# Altium schematic sheet XP3.SchDoc: XP3 Connections
size A; Organization: UCLA High Energy Physics; Address1: L3, 12a Rodborough Rd; Address2: Frenchs Forest; Address3: NSW; Address4: Australia 2086; DocumentNumber: 5; Revision: 2.0; SheetNumber: 5; SheetTotal: 23; CurrentDate: 9/6/2018; ModifiedDate: 9/6/2018; ProjectName: Project
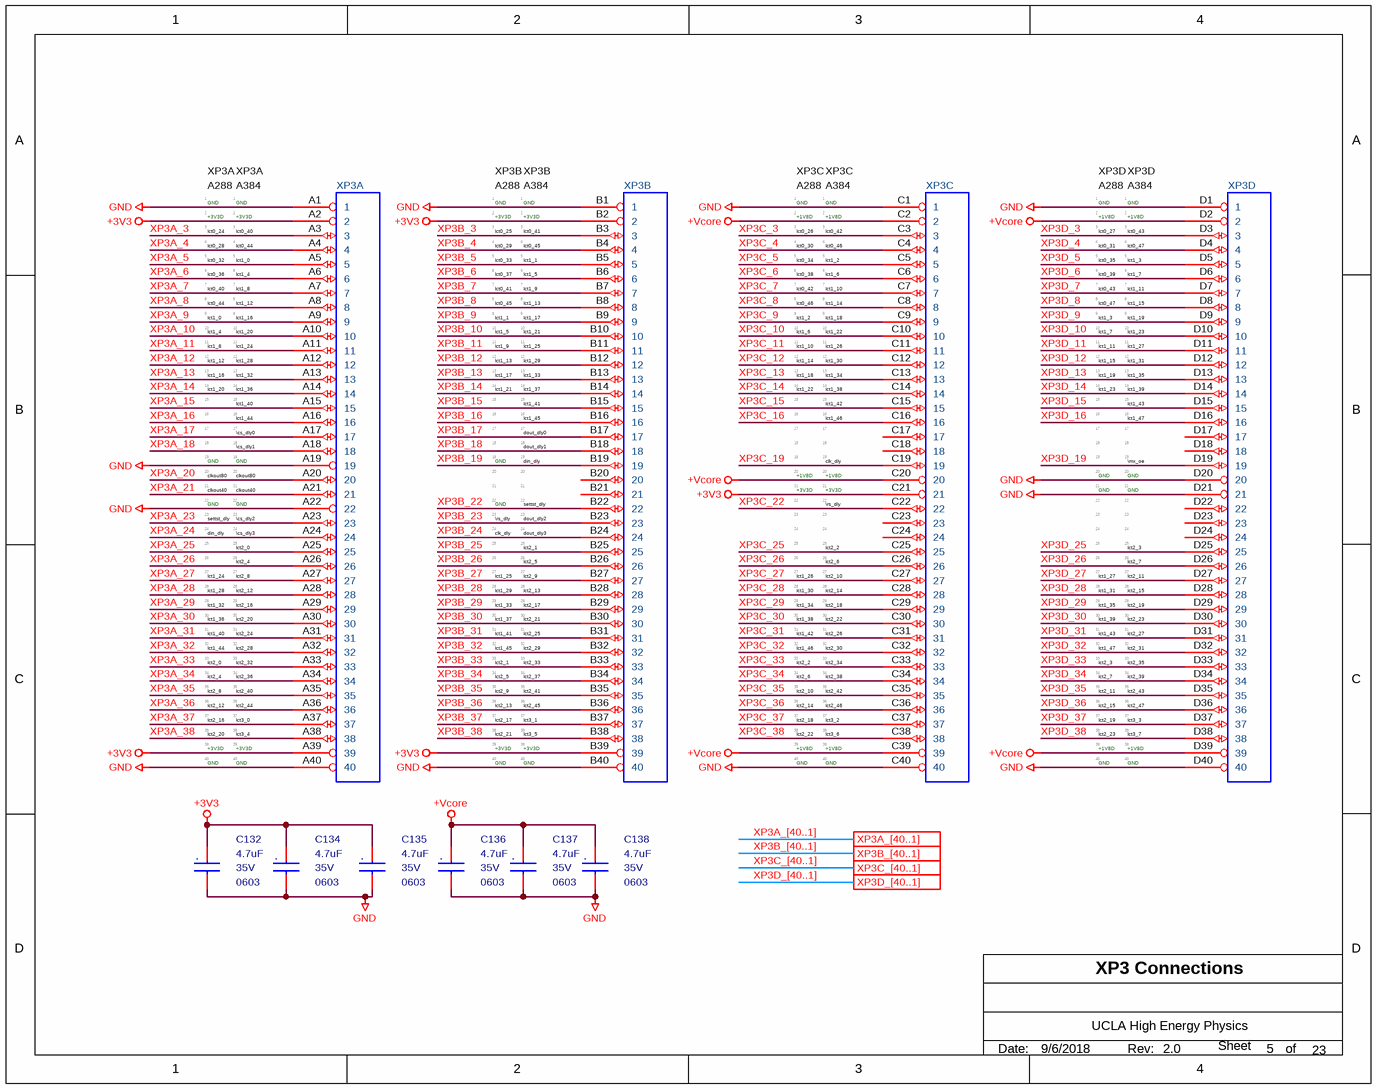
[diagram p0: XP3.SchDoc]

## Parts
(Parts that share a designator on the sheet are numbered #1, #2 ... from top to bottom, then left to right.)
C132  4.7uF  Voltage - Rated: 35V  package: 0603  [MC_S6/SM/C_0603_IPC]
C134  4.7uF  Voltage - Rated: 35V  package: 0603  [MC_S6/SM/C_0603_IPC]
C135  4.7uF  Voltage - Rated: 35V  package: 0603  [MC_S6/SM/C_0603_IPC]
C136  4.7uF  Voltage - Rated: 35V  package: 0603  [MC_S6/SM/C_0603_IPC]
C137  4.7uF  Voltage - Rated: 35V  package: 0603  [MC_S6/SM/C_0603_IPC]
C138  4.7uF  Voltage - Rated: 35V  package: 0603  [MC_S6/SM/C_0603_IPC]
XP3  Samtec_XP3  [MC_S6/TH/SAMTEC_MOLC_40x4]  (value not drawn)  (parts A,B,C,D of 4)
XP?#1  A288_XP3  (value not drawn)  (part A of 4)  (graphical)
XP?#2  A384_XP3  (value not drawn)  (part A of 4)  (graphical)
XP?#3  A288_XP3  (value not drawn)  (part B of 4)  (graphical)
XP?#4  A384_XP3  (value not drawn)  (part B of 4)  (graphical)
XP?#5  A288_XP3  (value not drawn)  (part C of 4)  (graphical)
XP?#6  A384_XP3  (value not drawn)  (part C of 4)  (graphical)
XP?#7  A288_XP3  (value not drawn)  (part D of 4)  (graphical)
XP?#8  A384_XP3  (value not drawn)  (part D of 4)  (graphical)

## Ports
XP3A_[40..1], XP3B_[40..1], XP3C_[40..1], XP3D_[40..1]

## Nets
+3V3: C132.1 C134.1 C135.1 XP3.A2(2) XP3.A39(39) XP3.B2(2) XP3.B39(39) XP3.C21(21)
+Vcore: C136.1 C137.1 C138.1 XP3.C2(2) XP3.C20(20) XP3.C39(39) XP3.D2(2) XP3.D39(39)
GND: C132.2 C134.2 C135.2 C136.2 C137.2 C138.2 XP3.A1(1) XP3.A19(19) XP3.A22(22) XP3.A40(40) XP3.B1(1) XP3.B40(40) XP3.C1(1) XP3.C40(40) XP3.D1(1) XP3.D20(20) XP3.D21(21) XP3.D40(40)
XP3A_3: XP3.A3(3)
XP3A_4: XP3.A4(4)
XP3A_5: XP3.A5(5)
XP3A_6: XP3.A6(6)
XP3A_7: XP3.A7(7)
XP3A_8: XP3.A8(8)
XP3A_9: XP3.A9(9)
XP3A_10: XP3.A10(10)
XP3A_11: XP3.A11(11)
XP3A_12: XP3.A12(12)
XP3A_13: XP3.A13(13)
XP3A_14: XP3.A14(14)
XP3A_15: XP3.A15(15)
XP3A_16: XP3.A16(16)
XP3A_17: XP3.A17(17)
XP3A_18: XP3.A18(18)
XP3A_20: XP3.A20(20)
XP3A_21: XP3.A21(21)
XP3A_23: XP3.A23(23)
XP3A_24: XP3.A24(24)
XP3A_25: XP3.A25(25)
XP3A_26: XP3.A26(26)
XP3A_27: XP3.A27(27)
XP3A_28: XP3.A28(28)
XP3A_29: XP3.A29(29)
XP3A_30: XP3.A30(30)
XP3A_31: XP3.A31(31)
XP3A_32: XP3.A32(32)
XP3A_33: XP3.A33(33)
XP3A_34: XP3.A34(34)
XP3A_35: XP3.A35(35)
XP3A_36: XP3.A36(36)
XP3A_37: XP3.A37(37)
XP3A_38: XP3.A38(38)
XP3B_3: XP3.B3(3)
XP3B_4: XP3.B4(4)
XP3B_5: XP3.B5(5)
XP3B_6: XP3.B6(6)
XP3B_7: XP3.B7(7)
XP3B_8: XP3.B8(8)
XP3B_9: XP3.B9(9)
XP3B_10: XP3.B10(10)
XP3B_11: XP3.B11(11)
XP3B_12: XP3.B12(12)
XP3B_13: XP3.B13(13)
XP3B_14: XP3.B14(14)
XP3B_15: XP3.B15(15)
XP3B_16: XP3.B16(16)
XP3B_17: XP3.B17(17)
XP3B_18: XP3.B18(18)
XP3B_19: XP3.B19(19)
XP3B_22: XP3.B22(22)
XP3B_23: XP3.B23(23)
XP3B_24: XP3.B24(24)
XP3B_25: XP3.B25(25)
XP3B_26: XP3.B26(26)
XP3B_27: XP3.B27(27)
XP3B_28: XP3.B28(28)
XP3B_29: XP3.B29(29)
XP3B_30: XP3.B30(30)
XP3B_31: XP3.B31(31)
XP3B_32: XP3.B32(32)
XP3B_33: XP3.B33(33)
XP3B_34: XP3.B34(34)
XP3B_35: XP3.B35(35)
XP3B_36: XP3.B36(36)
XP3B_37: XP3.B37(37)
XP3B_38: XP3.B38(38)
XP3C_3: XP3.C3(3)
XP3C_4: XP3.C4(4)
XP3C_5: XP3.C5(5)
XP3C_6: XP3.C6(6)
XP3C_7: XP3.C7(7)
XP3C_8: XP3.C8(8)
XP3C_9: XP3.C9(9)
XP3C_10: XP3.C10(10)
XP3C_11: XP3.C11(11)
XP3C_12: XP3.C12(12)
XP3C_13: XP3.C13(13)
XP3C_14: XP3.C14(14)
XP3C_15: XP3.C15(15)
XP3C_16: XP3.C16(16)
XP3C_19: XP3.C19(19)
XP3C_22: XP3.C22(22)
XP3C_25: XP3.C25(25)
XP3C_26: XP3.C26(26)
XP3C_27: XP3.C27(27)
XP3C_28: XP3.C28(28)
XP3C_29: XP3.C29(29)
XP3C_30: XP3.C30(30)
XP3C_31: XP3.C31(31)
XP3C_32: XP3.C32(32)
XP3C_33: XP3.C33(33)
XP3C_34: XP3.C34(34)
XP3C_35: XP3.C35(35)
XP3C_36: XP3.C36(36)
XP3C_37: XP3.C37(37)
XP3C_38: XP3.C38(38)
XP3D_3: XP3.D3(3)
XP3D_4: XP3.D4(4)
XP3D_5: XP3.D5(5)
XP3D_6: XP3.D6(6)
XP3D_7: XP3.D7(7)
XP3D_8: XP3.D8(8)
XP3D_9: XP3.D9(9)
XP3D_10: XP3.D10(10)
XP3D_11: XP3.D11(11)
XP3D_12: XP3.D12(12)
XP3D_13: XP3.D13(13)
XP3D_14: XP3.D14(14)
XP3D_15: XP3.D15(15)
XP3D_16: XP3.D16(16)
XP3D_19: XP3.D19(19)
XP3D_25: XP3.D25(25)
XP3D_26: XP3.D26(26)
XP3D_27: XP3.D27(27)
XP3D_28: XP3.D28(28)
XP3D_29: XP3.D29(29)
XP3D_30: XP3.D30(30)
XP3D_31: XP3.D31(31)
XP3D_32: XP3.D32(32)
XP3D_33: XP3.D33(33)
XP3D_34: XP3.D34(34)
XP3D_35: XP3.D35(35)
XP3D_36: XP3.D36(36)
XP3D_37: XP3.D37(37)
XP3D_38: XP3.D38(38)

Not connected (* = marked no-connect by the designer): XP3 B20(20) B21(21) C17(17) C18(18) C23(23) C24(24) D17(17) D18(18) D22(22) D23(23) D24(24)

## Buses and harness runs
bus XP3A_[40..1] = port XP3A_[40..1]
bus XP3B_[40..1] = port XP3B_[40..1]
bus XP3C_[40..1] = port XP3C_[40..1]
bus XP3D_[40..1] = port XP3D_[40..1]

## Notes on the sheet
- Date:
- Rev:
- of
- Sheet
- (in symbol A288_XP3, part A) XP3A; A288; 1; GND; 2; +3V3D; 3; lct0_24; 4; lct0_28; 5; lct0_32; 6; lct0_36; 7; lct0_40; 8; lct0_44; 9; lct1_0; 10; lct1_4; 11; lct1_8; 12; lct1_12; 13; lct1_16; 14; lct1_20; 15; 16; 17; 18; 19; 20; clkout80; 21; clkout40; 22; 23; settst_dly; 24; din_dly; 25; 26; 27; lct1_24; 28; lct1_28; 29; lct1_32; 30; lct1_36; 31; lct1_40; 32; lct1_44; 33; lct2_0; 34; lct2_4; 35; lct2_8; 36; lct2_12; 37; lct2_16; 38; lct2_20; 39; 40
- (in symbol A288_XP3, part B) XP3B; A288; 1; GND; 2; +3V3D; 3; lct0_25; 4; lct0_29; 5; lct0_33; 6; lct0_37; 7; lct0_41; 8; lct0_45; 9; lct1_1; 10; lct1_5; 11; lct1_9; 12; lct1_13; 13; lct1_17; 14; lct1_21; 15; 16; 17; 18; 19; 20; 21; 22; 23; \rs_dly; 24; clk_dly; 25; 26; 27; lct1_25; 28; lct1_29; 29; lct1_33; 30; lct1_37; 31; lct1_41; 32; lct1_45; 33; lct2_1; 34; lct2_5; 35; lct2_9; 36; lct2_13; 37; lct2_17; 38; lct2_21; 39; 40
- (in symbol A288_XP3, part C) XP3C; A288; 1; GND; 2; +1V8D; 3; lct0_26; 4; lct0_30; 5; lct0_34; 6; lct0_38; 7; lct0_42; 8; lct0_46; 9; lct1_2; 10; lct1_6; 11; lct1_10; 12; lct1_14; 13; lct1_18; 14; lct1_22; 15; 16; 17; 18; 19; 20; 21; +3V3D; 22; 23; 24; 25; 26; 27; lct1_26; 28; lct1_30; 29; lct1_34; 30; lct1_38; 31; lct1_42; 32; lct1_46; 33; lct2_2; 34; lct2_6; 35; lct2_10; 36; lct2_14; 37; lct2_18; 38; lct2_22; 39; 40
- (in symbol A288_XP3, part D) XP3D; A288; 1; GND; 2; +1V8D; 3; lct0_27; 4; lct0_31; 5; lct0_35; 6; lct0_39; 7; lct0_43; 8; lct0_47; 9; lct1_3; 10; lct1_7; 11; lct1_11; 12; lct1_15; 13; lct1_19; 14; lct1_23; 15; 16; 17; 18; 19; 20; 21; 22; 23; 24; 25; 26; 27; lct1_27; 28; lct1_31; 29; lct1_35; 30; lct1_39; 31; lct1_43; 32; lct1_47; 33; lct2_3; 34; lct2_7; 35; lct2_11; 36; lct2_15; 37; lct2_19; 38; lct2_23; 39; 40
- (in symbol A384_XP3, part A) XP3A; A384; 1; GND; 2; +3V3D; 3; lct0_40; 4; lct0_44; 5; lct1_0; 6; lct1_4; 7; lct1_8; 8; lct1_12; 9; lct1_16; 10; lct1_20; 11; lct1_24; 12; lct1_28; 13; lct1_32; 14; lct1_36; 15; lct1_40; 16; lct1_44; 17; \cs_dly0; 18; \cs_dly1; 19; 20; clkout80; 21; clkout40; 22; 23; \cs_dly2; 24; \cs_dly3; 25; lct2_0; 26; lct2_4; 27; lct2_8; 28; lct2_12; 29; lct2_16; 30; lct2_20; 31; lct2_24; 32; lct2_28; 33; lct2_32; 34; lct2_36; 35; lct2_40; 36; lct2_44; 37; lct3_0; 38; lct3_4; 39; 40
- (in symbol A384_XP3, part B) XP3B; A384; 1; GND; 2; +3V3D; 3; lct0_41; 4; lct0_45; 5; lct1_1; 6; lct1_5; 7; lct1_9; 8; lct1_13; 9; lct1_17; 10; lct1_21; 11; lct1_25; 12; lct1_29; 13; lct1_33; 14; lct1_37; 15; lct1_41; 16; lct1_45; 17; dout_dly0; 18; dout_dly1; 19; din_dly; 20; 21; 22; settst_dly; 23; dout_dly2; 24; dout_dly3; 25; lct2_1; 26; lct2_5; 27; lct2_9; 28; lct2_13; 29; lct2_17; 30; lct2_21; 31; lct2_25; 32; lct2_29; 33; lct2_33; 34; lct2_37; 35; lct2_41; 36; lct2_45; 37; lct3_1; 38; lct3_5; 39; 40
- (in symbol A384_XP3, part C) XP3C; A384; 1; GND; 2; +1V8D; 3; lct0_42; 4; lct0_46; 5; lct1_2; 6; lct1_6; 7; lct1_10; 8; lct1_14; 9; lct1_18; 10; lct1_22; 11; lct1_26; 12; lct1_30; 13; lct1_34; 14; lct1_38; 15; lct1_42; 16; lct1_46; 17; 18; 19; clk_dly; 20; 21; +3V3D; 22; \rs_dly; 23; 24; 25; lct2_2; 26; lct2_6; 27; lct2_10; 28; lct2_14; 29; lct2_18; 30; lct2_22; 31; lct2_26; 32; lct2_30; 33; lct2_34; 34; lct2_38; 35; lct2_42; 36; lct2_46; 37; lct3_2; 38; lct3_6; 39; 40
- (in symbol A384_XP3, part D) XP3D; A384; 1; GND; 2; +1V8D; 3; lct0_43; 4; lct0_47; 5; lct1_3; 6; lct1_7; 7; lct1_11; 8; lct1_15; 9; lct1_19; 10; lct1_23; 11; lct1_27; 12; lct1_31; 13; lct1_35; 14; lct1_39; 15; lct1_43; 16; lct1_47; 17; 18; 19; \mx_oe; 20; 21; 22; 23; 24; 25; lct2_3; 26; lct2_7; 27; lct2_11; 28; lct2_15; 29; lct2_19; 30; lct2_23; 31; lct2_27; 32; lct2_31; 33; lct2_35; 34; lct2_39; 35; lct2_43; 36; lct2_47; 37; lct3_3; 38; lct3_7; 39; 40
- (in symbol GRM188R6YA475KE15D) .
- (in symbol Samtec_XP3, part A) XP3A
- (in symbol Samtec_XP3, part B) XP3B
- (in symbol Samtec_XP3, part C) XP3C
- (in symbol Samtec_XP3, part D) XP3D

## Library data of the parts
C132 C134-C138 = GRM188R6YA475KE15D: CAP CER 4.7UF 35V X5R 0603; Manufacturer: Murata; Product Training Modules: High-Cap Multilayer Ceramic Capacitors; Featured Product: GA3 Safety Recognized Capacitors; EDA / CAD Models: Download from Accelerated Designs; Capacitance: 4.7µF; Tolerance: ±10%; Online Catalog: GRM Series; Other Names: 490-7205-2; Supplier 1: Digikey; Manufacturer Part Number: GRM188R6YA475KE15D; Stock 1: 180441; Pricing 1: 1=0.32, 10=0.264, 50=0.1486, 100=0.132, 250=0.099, 500=0.0875, 1000=0.0776 (USD); Standard Package: 4,000; Category: Capacitors; Family: Ceramic Capacitors; Series: GRM; Packaging: Tape & Reel (TR); Temperature Coefficient: X5R; Mounting Type: Surface Mount, MLCC; Operating Temperature: -55°C ~ 85°C; Applications: General Purpose; Package / Case: 0603 (1608 Metric); Size / Dimension: 0.063" L x 0.031" W (1.60mm x 0.80mm); Thickness (Max): 0.031" (0.80mm); ComponentLink1URL: https://datasheet.ciiva.com/46444/1769893-46444984.pdf; ComponentLink1Description: https://datasheet.ciiva.com/46444/1769893-46444984.pdf; ComponentLink2URL: https://datasheet.ciiva.com/46444/1769893-46444985.pdf; ComponentLink2Description: https://datasheet.ciiva.com/46444/1769893-46444985.pdf; ComponentLink3URL: https://datasheet.ciiva.com/14906/partnumbering-e-01-14906426.pdf; ComponentLink3Description: https://datasheet.ciiva.com/14906/partnumbering-e-01-14906426.pdf; ComponentLink4URL: https://datasheet.ciiva.com/14906/partnumbering-e-01-14906427.pdf; ComponentLink4Description: https://datasheet.ciiva.com/14906/partnumbering-e-01-14906427.pdf; ComponentLink5URL: https://datasheet.ciiva.com/14906/partnumbering-e-01-14906428.pdf; ComponentLink5Description: https://datasheet.ciiva.com/14906/partnumbering-e-01-14906428.pdf; Supplier 2: Digikey; Stock 2: 180441; Pricing 2: 1=0.32, 10=0.264, 50=0.1486, 100=0.132, 250=0.099, 500=0.0875, 1000=0.0776 (USD); Supplier Part Number 1: 490-7205-1-ND; Supplier Part Number 2: 490-7205-6-ND
XP3 = Samtec_XP3: Manufacturer Part Number: MOLC-140-01-L-Q-LC; mfgr_id: MOLC-140-01-S-Q-LC; mfgr: Samtec; mfgr_foot: 40x4; COMPROT: 270; COMPGROUP: 0; COMPSIDE: TOP; Contact Termination Type: Through Hole; Gender: Header; No. of Contacts: 160; No. of Rows: 4; Pitch Spacing: 1.27; Product Range: MOLC Series; SVHC: No SVHC (12-Jan-2017; Package: XP3; ComponentLink1Description: http://www.farnell.com/cad/2261282.pdf; ComponentLink1URL: http://www.farnell.com/cad/2261282.pdf; ComponentLink2Description: http://www.farnell.com/datasheets/2261038.pdf; ComponentLink2URL: http://www.farnell.com/datasheets/2261038.pdf; Contact Material: Phosphor Bronze; Contact Plating: Gold Plated Contacts; Manufacturer: SAMTEC; Pricing 1: 1=18.16, 3=17.11, 5=16.18, 10=15.35, 15=14.96, 25=14.34 (GBP); RoHS: YES; Stock 1: 0; Supplier 1: Farnell; Supplier Part Number 1: 2732055
XP?#1 XP?#3 XP?#5 XP?#7 = A288_XP3: mfgr_id: MOLC-140-01-S-Q-LC; mfgr: Samtec; mfgr_foot: 40x4; COMPROT: 180; COMPGROUP: 0; COMPSIDE: TOP; Package: XP3
XP?#2 XP?#4 XP?#6 XP?#8 = A384_XP3: mfgr_id: MOLC-140-01-S-Q-LC; mfgr: Samtec; mfgr_foot: 40x4; COMPROT: 180; COMPGROUP: 0; COMPSIDE: TOP; Package: XP3